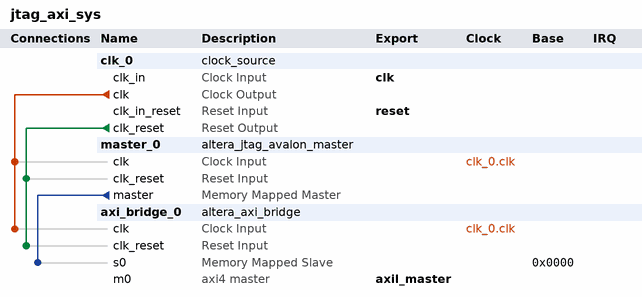
[diagram p0: system contents]
# Platform Designer (Qsys) system jtag_axi_sys, Cyclone IV E EP4CE115F29C7
# Parameters at their usual value, and those the tool derives, are not listed.
package require -exact qsys 18.0
create_system jtag_axi_sys
set_project_property DEVICE_FAMILY {Cyclone IV E}
set_project_property DEVICE EP4CE115F29C7

add_instance clk_0 clock_source 18.0
set_instance_parameter_value clk_0 clockFrequency 50000000

add_instance master_0 altera_jtag_avalon_master 18.0

add_instance axi_bridge_0 altera_axi_bridge 18.0
set_instance_parameter_value axi_bridge_0 ADDR_WIDTH 32
set_instance_parameter_value axi_bridge_0 AXI_VERSION AXI4
set_instance_parameter_value axi_bridge_0 COMBINED_ACCEPTANCE_CAPABILITY 16
set_instance_parameter_value axi_bridge_0 COMBINED_ISSUING_CAPABILITY 16
set_instance_parameter_value axi_bridge_0 DATA_WIDTH 32
set_instance_parameter_value axi_bridge_0 M0_ID_WIDTH 8
set_instance_parameter_value axi_bridge_0 READ_ACCEPTANCE_CAPABILITY 16
set_instance_parameter_value axi_bridge_0 READ_ADDR_USER_WIDTH 1
set_instance_parameter_value axi_bridge_0 READ_DATA_REORDERING_DEPTH 1
set_instance_parameter_value axi_bridge_0 READ_DATA_USER_WIDTH 1
set_instance_parameter_value axi_bridge_0 READ_ISSUING_CAPABILITY 16
set_instance_parameter_value axi_bridge_0 S0_ID_WIDTH 8
set_instance_parameter_value axi_bridge_0 USE_M0_ARBURST 1
set_instance_parameter_value axi_bridge_0 USE_M0_ARCACHE 1
set_instance_parameter_value axi_bridge_0 USE_M0_ARID 1
set_instance_parameter_value axi_bridge_0 USE_M0_ARLEN 1
set_instance_parameter_value axi_bridge_0 USE_M0_ARLOCK 1
set_instance_parameter_value axi_bridge_0 USE_M0_ARQOS 1
set_instance_parameter_value axi_bridge_0 USE_M0_ARREGION 1
set_instance_parameter_value axi_bridge_0 USE_M0_ARSIZE 1
set_instance_parameter_value axi_bridge_0 USE_M0_ARUSER 0
set_instance_parameter_value axi_bridge_0 USE_M0_AWBURST 1
set_instance_parameter_value axi_bridge_0 USE_M0_AWCACHE 1
set_instance_parameter_value axi_bridge_0 USE_M0_AWID 1
set_instance_parameter_value axi_bridge_0 USE_M0_AWLEN 1
set_instance_parameter_value axi_bridge_0 USE_M0_AWLOCK 1
set_instance_parameter_value axi_bridge_0 USE_M0_AWQOS 1
set_instance_parameter_value axi_bridge_0 USE_M0_AWREGION 1
set_instance_parameter_value axi_bridge_0 USE_M0_AWSIZE 1
set_instance_parameter_value axi_bridge_0 USE_M0_AWUSER 0
set_instance_parameter_value axi_bridge_0 USE_M0_BID 1
set_instance_parameter_value axi_bridge_0 USE_M0_BRESP 1
set_instance_parameter_value axi_bridge_0 USE_M0_BUSER 0
set_instance_parameter_value axi_bridge_0 USE_M0_RID 1
set_instance_parameter_value axi_bridge_0 USE_M0_RLAST 1
set_instance_parameter_value axi_bridge_0 USE_M0_RRESP 1
set_instance_parameter_value axi_bridge_0 USE_M0_RUSER 0
set_instance_parameter_value axi_bridge_0 USE_M0_WSTRB 1
set_instance_parameter_value axi_bridge_0 USE_M0_WUSER 0
set_instance_parameter_value axi_bridge_0 USE_PIPELINE 1
set_instance_parameter_value axi_bridge_0 USE_S0_ARCACHE 1
set_instance_parameter_value axi_bridge_0 USE_S0_ARLOCK 1
set_instance_parameter_value axi_bridge_0 USE_S0_ARPROT 1
set_instance_parameter_value axi_bridge_0 USE_S0_ARQOS 1
set_instance_parameter_value axi_bridge_0 USE_S0_ARREGION 1
set_instance_parameter_value axi_bridge_0 USE_S0_ARUSER 0
set_instance_parameter_value axi_bridge_0 USE_S0_AWCACHE 1
set_instance_parameter_value axi_bridge_0 USE_S0_AWLOCK 1
set_instance_parameter_value axi_bridge_0 USE_S0_AWPROT 1
set_instance_parameter_value axi_bridge_0 USE_S0_AWQOS 1
set_instance_parameter_value axi_bridge_0 USE_S0_AWREGION 1
set_instance_parameter_value axi_bridge_0 USE_S0_AWUSER 0
set_instance_parameter_value axi_bridge_0 USE_S0_BRESP 1
set_instance_parameter_value axi_bridge_0 USE_S0_BUSER 0
set_instance_parameter_value axi_bridge_0 USE_S0_RRESP 1
set_instance_parameter_value axi_bridge_0 USE_S0_RUSER 0
set_instance_parameter_value axi_bridge_0 USE_S0_WLAST 1
set_instance_parameter_value axi_bridge_0 USE_S0_WUSER 0
set_instance_parameter_value axi_bridge_0 WRITE_ACCEPTANCE_CAPABILITY 16
set_instance_parameter_value axi_bridge_0 WRITE_ADDR_USER_WIDTH 1
set_instance_parameter_value axi_bridge_0 WRITE_DATA_USER_WIDTH 1
set_instance_parameter_value axi_bridge_0 WRITE_ISSUING_CAPABILITY 16
set_instance_parameter_value axi_bridge_0 WRITE_RESP_USER_WIDTH 1

# connections
add_connection clk_0.clk axi_bridge_0.clk clock
add_connection clk_0.clk master_0.clk clock
add_connection clk_0.clk_reset axi_bridge_0.clk_reset reset
add_connection clk_0.clk_reset master_0.clk_reset reset
add_connection master_0.master axi_bridge_0.s0 avalon
set_connection_parameter_value master_0.master/axi_bridge_0.s0 baseAddress 0x0000

# exported interfaces
add_interface axil_master axi4 master
set_interface_property axil_master EXPORT_OF axi_bridge_0.m0
add_interface clk clock sink
set_interface_property clk EXPORT_OF clk_0.clk_in
add_interface reset reset sink
set_interface_property reset EXPORT_OF clk_0.clk_in_reset

set_interconnect_requirement {$system} qsys_mm.clockCrossingAdapter HANDSHAKE
set_interconnect_requirement {$system} qsys_mm.enableEccProtection FALSE
set_interconnect_requirement {$system} qsys_mm.insertDefaultSlave FALSE
set_interconnect_requirement {$system} qsys_mm.maxAdditionalLatency 1

save_system jtag_axi_sys.qsys
